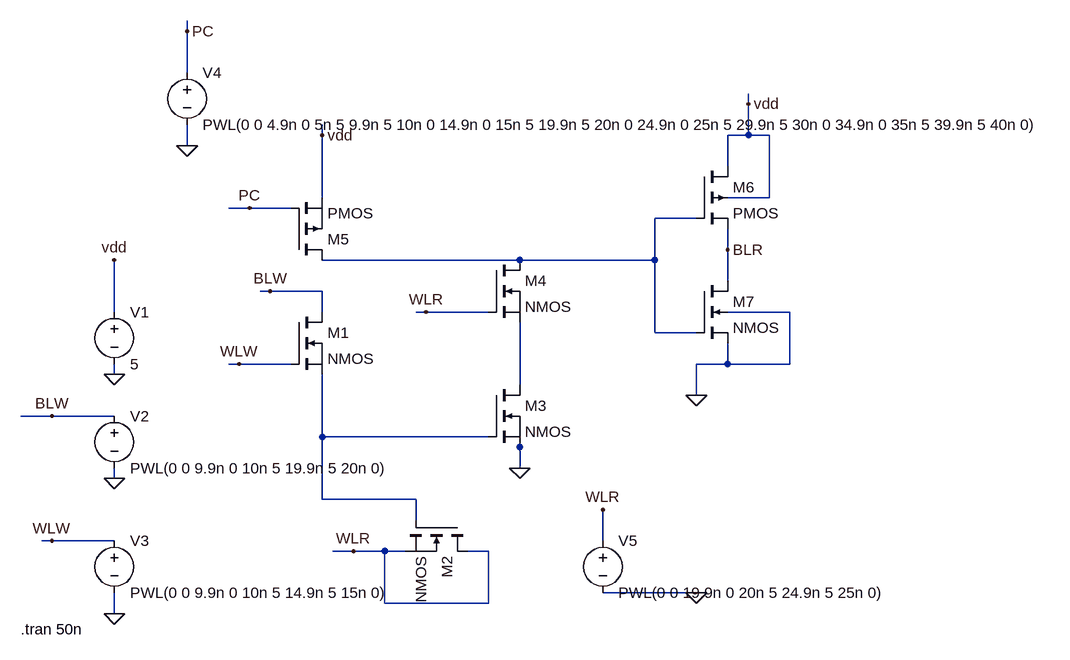
[diagram p0: schematic 3T_1D_1_tst.asc]
3T_1D_1_tst.asc, the LTspice schematic file:
Version 4
SHEET 1 1480 680
WIRE 48 -400 48 -416
WIRE 48 -336 48 -400
WIRE 912 -288 912 -304
WIRE 256 -240 256 -256
WIRE 912 -240 912 -288
WIRE 912 -240 880 -240
WIRE 944 -240 912 -240
WIRE 48 -224 48 -256
WIRE 880 -192 880 -240
WIRE 256 -144 256 -240
WIRE 944 -144 944 -240
WIRE 944 -144 880 -144
WIRE 144 -128 112 -128
WIRE 208 -128 144 -128
WIRE 832 -112 768 -112
WIRE 880 -64 880 -96
WIRE 560 -48 256 -48
WIRE 768 -48 768 -112
WIRE 768 -48 560 -48
WIRE 880 -16 880 -64
WIRE 176 0 160 0
WIRE 256 0 176 0
WIRE -64 32 -64 -48
WIRE 256 32 256 0
WIRE 416 32 400 32
WIRE 512 32 416 32
WIRE 976 32 880 32
WIRE 768 64 768 -48
WIRE 832 64 768 64
WIRE 128 112 112 112
WIRE 208 112 128 112
WIRE 880 112 880 80
WIRE 880 112 832 112
WIRE 976 112 976 32
WIRE 976 112 880 112
WIRE -64 128 -64 112
WIRE 560 144 560 48
WIRE 832 160 832 112
WIRE -160 192 -208 192
WIRE -64 192 -160 192
WIRE 256 224 256 128
WIRE 512 224 256 224
WIRE 560 240 560 224
WIRE 560 272 560 240
WIRE -64 288 -64 272
WIRE 256 320 256 224
WIRE 400 320 256 320
WIRE 400 352 400 320
WIRE -160 384 -176 384
WIRE -64 384 -160 384
WIRE 688 384 688 336
WIRE 304 400 272 400
WIRE 352 400 304 400
WIRE 384 400 352 400
WIRE 512 400 480 400
WIRE 832 464 688 464
WIRE 848 464 832 464
WIRE 352 480 352 400
WIRE 512 480 512 400
WIRE 512 480 352 480
WIRE -64 496 -64 464
FLAG -64 128 0
FLAG -64 288 0
FLAG -64 496 0
FLAG 560 272 0
FLAG 832 160 0
FLAG -64 -48 vdd
FLAG -160 192 BLW
FLAG -160 384 WLW
FLAG 256 -240 vdd
FLAG 912 -288 vdd
FLAG 176 0 BLW
FLAG 128 112 WLW
FLAG 304 400 WLR
FLAG 416 32 WLR
FLAG 688 336 WLR
FLAG 144 -128 PC
FLAG 880 -64 BLR
FLAG 48 -224 0
FLAG 48 -400 PC
FLAG 832 464 0
SYMBOL voltage -64 16 R0
WINDOW 123 0 0 Left 0
WINDOW 39 0 0 Left 0
SYMATTR InstName V1
SYMATTR Value 5
SYMBOL voltage -64 176 R0
WINDOW 123 0 0 Left 0
WINDOW 39 0 0 Left 0
SYMATTR InstName V2
SYMATTR Value PWL(0 0 9.9n 0 10n 5 19.9n 5 20n 0)
SYMBOL voltage -64 368 R0
WINDOW 123 0 0 Left 0
WINDOW 39 0 0 Left 0
SYMATTR InstName V3
SYMATTR Value PWL(0 0 9.9n 0 10n 5 14.9n 5 15n 0)
SYMBOL nmos 208 32 R0
SYMATTR InstName M1
SYMBOL nmos 480 352 R90
SYMATTR InstName M2
SYMBOL nmos 512 144 R0
SYMATTR InstName M3
SYMBOL nmos 512 -48 R0
SYMATTR InstName M4
SYMBOL pmos 208 -48 M180
SYMATTR InstName M5
SYMBOL pmos4 832 -192 R0
SYMATTR InstName M6
SYMBOL nmos4 832 -16 R0
SYMATTR InstName M7
SYMBOL voltage 48 -352 R0
WINDOW 123 0 0 Left 0
WINDOW 39 0 0 Left 0
SYMATTR InstName V4
SYMATTR Value PWL(0 0 4.9n 0 5n 5 9.9n 5 10n 0 14.9n 0 15n 5 19.9n 5 20n 0 24.9n 0 25n 5 29.9n 5 30n 0 34.9n 0 35n 5 39.9n 5 40n 0)
SYMBOL voltage 688 368 R0
WINDOW 123 0 0 Left 0
WINDOW 39 0 0 Left 0
SYMATTR InstName V5
SYMATTR Value PWL(0 0 19.9n 0 20n 5 24.9n 5 25n 0)
TEXT -208 520 Left 2 !.tran 50n

The netlist it stands for:
* 3T_1D_1_tst.asc
V1 vdd 0 5
V2 BLW 0 PWL(0 0 9.9n 0 10n 5 19.9n 5 20n 0)
V3 WLW 0 PWL(0 0 9.9n 0 10n 5 14.9n 5 15n 0)
M1 BLW WLW N003 N003 NMOS
M2 WLR N003 WLR WLR NMOS
M3 N002 N003 0 0 NMOS
M4 N001 WLR N002 N002 NMOS
M5 N001 PC vdd vdd PMOS
M6 vdd N001 BLR vdd PMOS
M7 BLR N001 0 0 NMOS
V4 PC 0 PWL(0 0 4.9n 0 5n 5 9.9n 5 10n 0 14.9n 0 15n 5 19.9n 5 20n 0 24.9n 0 25n 5 29.9n 5 30n 0 34.9n 0 35n 5 39.9n 5 40n 0)
V5 WLR 0 PWL(0 0 19.9n 0 20n 5 24.9n 5 25n 0)
.model NMOS NMOS
.model PMOS PMOS
.lib standard.mos
.tran 50n
.backanno
.end